# EAGLE design servo_board - no power (EAGLE 5.06)
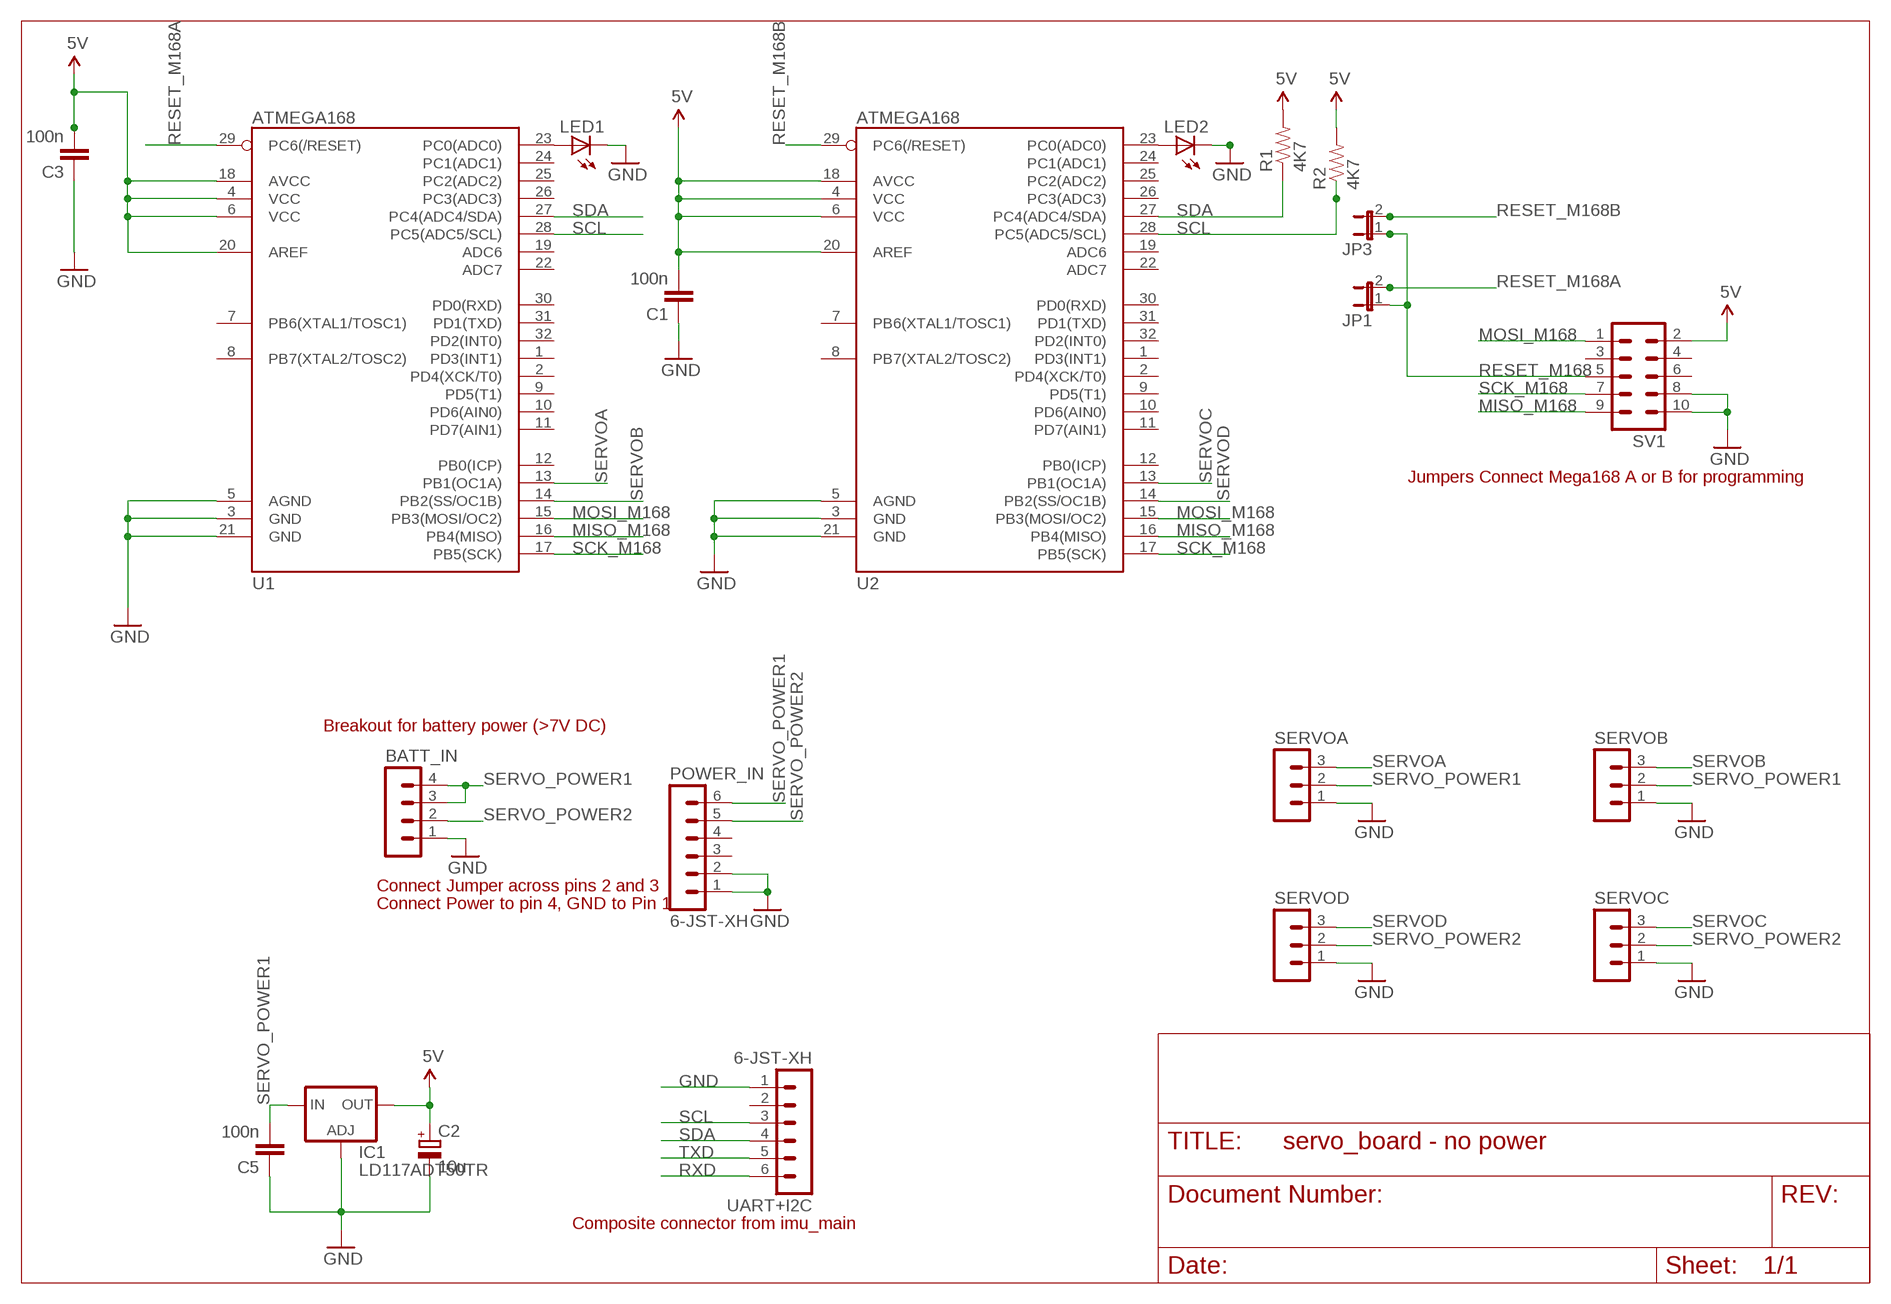
[diagram p0: schematic, sheet 1]

## Parts
BATT_IN  MA04-1  [MA04-1]
C1  100n  C-EUC0805  [C0805]
C2  10u  CPOL-EUC/6032-28R  [C/6032-28R]
C3  100n  C-EUC0805  [C0805]
C5  100n  C-EUC0805  [C0805]
IC1  LD117ADT50TR  [DPACK]
JP1  JP1E  [JP1]
JP3  JP1E  [JP1]
LED1  LEDSMT1206  [1206]
LED2  LEDSMT1206  [1206]
POWER_IN  6-JST-XH  [6]
R1  4K7  RESISTOR0603-RES  [0603-RES]
R2  4K7  RESISTOR0603-RES  [0603-RES]
SERVOA  MA03-1  [MA03-1]
SERVOB  MA03-1  [MA03-1]
SERVOC  MA03-1  [MA03-1]
SERVOD  MA03-1  [MA03-1]
SV1  MA05-2LARGE_PAD  [MA05-2A]
U1  ATMEGA168  [TQFP32-08]
U2  ATMEGA168  [TQFP32-08]
UART+I2C  6-JST-XH  [6]

## Nets
5V: C1.2 C2.+ C3.2 IC1.4(OUT) R1.2 R2.2 SV1.2 U1.4(VCC) U1.6(VCC) U1.18(AVCC) U1.20(AREF) U2.4(VCC) U2.6(VCC) U2.18(AVCC) U2.20(AREF)
GND: BATT_IN.1 C1.1 C2.- C3.1 C5.1 IC1.1(ADJ) LED1.C LED2.C POWER_IN.1 POWER_IN.2 SERVOA.1 SERVOB.1 SERVOC.1 SERVOD.1 SV1.8 SV1.10 U1.3(GND) U1.5(AGND) U1.21(GND) U2.3(GND) U2.5(AGND) U2.21(GND) UART+I2C.1
MISO_M168: SV1.9 U1.16(PB4(MISO)) U2.16(PB4(MISO))
MOSI_M168: SV1.1 U1.15(PB3(MOSI/OC2)) U2.15(PB3(MOSI/OC2))
N$8: LED1.A U1.23(PC0(ADC0))
N$9: LED2.A U2.23(PC0(ADC0))
RESET_M168: JP1.1 JP3.1 SV1.5
RESET_M168A: JP1.2 U1.29(PC6(/RESET))
RESET_M168B: JP3.2 U2.29(PC6(/RESET))
RXD: UART+I2C.6
SCK_M168: SV1.7 U1.17(PB5(SCK)) U2.17(PB5(SCK))
SCL: R2.1 U1.28(PC5(ADC5/SCL)) U2.28(PC5(ADC5/SCL)) UART+I2C.3
SDA: R1.1 U1.27(PC4(ADC4/SDA)) U2.27(PC4(ADC4/SDA)) UART+I2C.4
SERVO_POWER1: BATT_IN.3 BATT_IN.4 C5.2 IC1.3(IN) POWER_IN.6 SERVOA.2 SERVOB.2
SERVO_POWER2: BATT_IN.2 POWER_IN.5 SERVOC.2 SERVOD.2
SERVOA: SERVOA.3 U1.13(PB1(OC1A))
SERVOB: SERVOB.3 U1.14(PB2(SS/OC1B))
SERVOC: SERVOC.3 U2.13(PB1(OC1A))
SERVOD: SERVOD.3 U2.14(PB2(SS/OC1B))
TXD: UART+I2C.5
Unconnected: POWER_IN.3 POWER_IN.4 SV1.3 SV1.4 SV1.6 U1.1(PD3(INT1)) U1.2(PD4(XCK/T0)) U1.7(PB6(XTAL1/TOSC1)) U1.8(PB7(XTAL2/TOSC2)) U1.9(PD5(T1)) U1.10(PD6(AIN0)) U1.11(PD7(AIN1)) U1.12(PB0(ICP)) U1.19(ADC6) U1.22(ADC7) U1.24(PC1(ADC1)) U1.25(PC2(ADC2)) U1.26(PC3(ADC3)) U1.30(PD0(RXD)) U1.31(PD1(TXD)) U1.32(PD2(INT0)) U2.1(PD3(INT1)) U2.2(PD4(XCK/T0)) U2.7(PB6(XTAL1/TOSC1)) U2.8(PB7(XTAL2/TOSC2)) U2.9(PD5(T1)) U2.10(PD6(AIN0)) U2.11(PD7(AIN1)) U2.12(PB0(ICP)) U2.19(ADC6) U2.22(ADC7) U2.24(PC1(ADC1)) U2.25(PC2(ADC2)) U2.26(PC3(ADC3)) U2.30(PD0(RXD)) U2.31(PD1(TXD)) U2.32(PD2(INT0)) UART+I2C.2

## Notes on the sheet
- Jumpers Connect Mega168 A or B for programming
- Breakout for battery power (>7V DC)
- Connect Jumper across pins 2 and 3
- Connect Power to pin 4, GND to Pin 1
- Composite connector from imu_main

## Library data of the parts
BATT_IN = con-lstb:MA04-1: PIN HEADER
C1 C3 C5 = rcl:C-EU: CAPACITOR, European symbol
C2 = rcl:CPOL-EU: POLARIZED CAPACITOR, European symbol
IC1 = v-reg:LD117A?*: Low drop fixed and adjustable positive voltage regulators 1 A Source: http://www.st.com/stonline/products/literature/ds/7194/ld1117axx.pdf
JP1 JP3 = jumper:JP1E: JUMPER
LED1 LED2 = led:LED: LED OSRAM: - CHIPLED LG R971, LG N971, LY N971, LG Q971, LY Q971, LO R971, LY R971 LH N974, LH R974 LS Q976, LO Q976, LY Q976 LO Q996 - Hyper CHIPLED LW Q18S LB Q993, LB Q99A, LB R99A - SideLED LS A670, LO A670, LY A670, LG A670, LP A670 LB A673, LV A673, LT A673, LW A673 LH A674 LY A675 LS A676, LA A676, LO A676, LY A676, LW A676 LS A679, LY A679, LG A679 - Hyper Micro SIDELED® LS Y876, LA Y876, LO Y876, LY Y876 LT Y87S - SmartLED LW L88C, LW L88S LB L89C, LB L89S, LG L890 LS L89K, LO L89K, LY L89K LS L896, LA L896, LO L896, LY L896 - TOPLED LS T670, LO T670, LY T670, LG T670, LP T670 LSG T670, LSP T670, LSY T670, LOP T670, LYG T670 LG T671, LOG T671, LSG T671 LB T673, LV T673, LT T673, LW T673 LH T674 LS T676, LA T676, LO T676, LY T676, LB T676, LH T676, LSB T676, LW T676 LB T67C, LV T67C, LT T67C, LS T67K, LO T67K, LY T67K, LW E67C LS E67B, LA E67B, LO E67B, LY E67B, LB E67C, LV E67C, LT E67C LW T67C LS T679, LY T679, LG T679 LS T770, LO T770, LY T770, LG T770, LP T770 LB T773, LV T773, LT T773, LW T773 LH T774 LS E675, LA E675, LY E675, LS T675 LS T776, LA T776, LO T776, LY T776, LB T776 LHGB T686 LT T68C, LB T68C - Hyper Mini TOPLED® LB M676 - Mini TOPLED Santana® LG M470 LS M47K, LO M47K, LY M47K Source: http://www.osram.convergy.de LUXEON: - LUMILED® LXK2-PW12-R00, LXK2-PW12-S00, LXK2-PW14-U00, LXK2-PW14-V00 LXK2-PM12-R00, LXK2-PM12-S00, LXK2-PM14-U00 LXK2-PE12-Q00, LXK2-PE12-R00, LXK2-PE12-S00, LXK2-PE14-T00, LXK2-PE14-U00 LXK2-PB12-K00, LXK2-PB12-L00, LXK2-PB12-M00, LXK2-PB14-N00, LXK2-PB14-P00, LXK2-PB14-Q00 LXK2-PR12-L00, LXK2-PR12-M00, LXK2-PR14-Q00, LXK2-PR14-R00 LXK2-PD12-Q00, LXK2-PD12-R00, LXK2-PD12-S00 LXK2-PH12-R00, LXK2-PH12-S00 LXK2-PL12-P00, LXK2-PL12-Q00, LXK2-PL12-R00 Source: www.luxeon.com KINGBRIGHT: KA-3528ASYC Source: www.kingbright.com
POWER_IN UART+I2C = con-jst-xh:6-JST-XH
R1 R2 = SparkFun:RESISTOR: Resistor Basic schematic elements and footprints for 0603, 1206, and PTH 1/10th watt (small) resistors.
SERVOA SERVOB SERVOC SERVOD = con-lstb:MA03-1: PIN HEADER
SV1 = con-lstb:MA05-2: PIN HEADER
U1 U2 = SparkFun:ATMEGA168

## Board
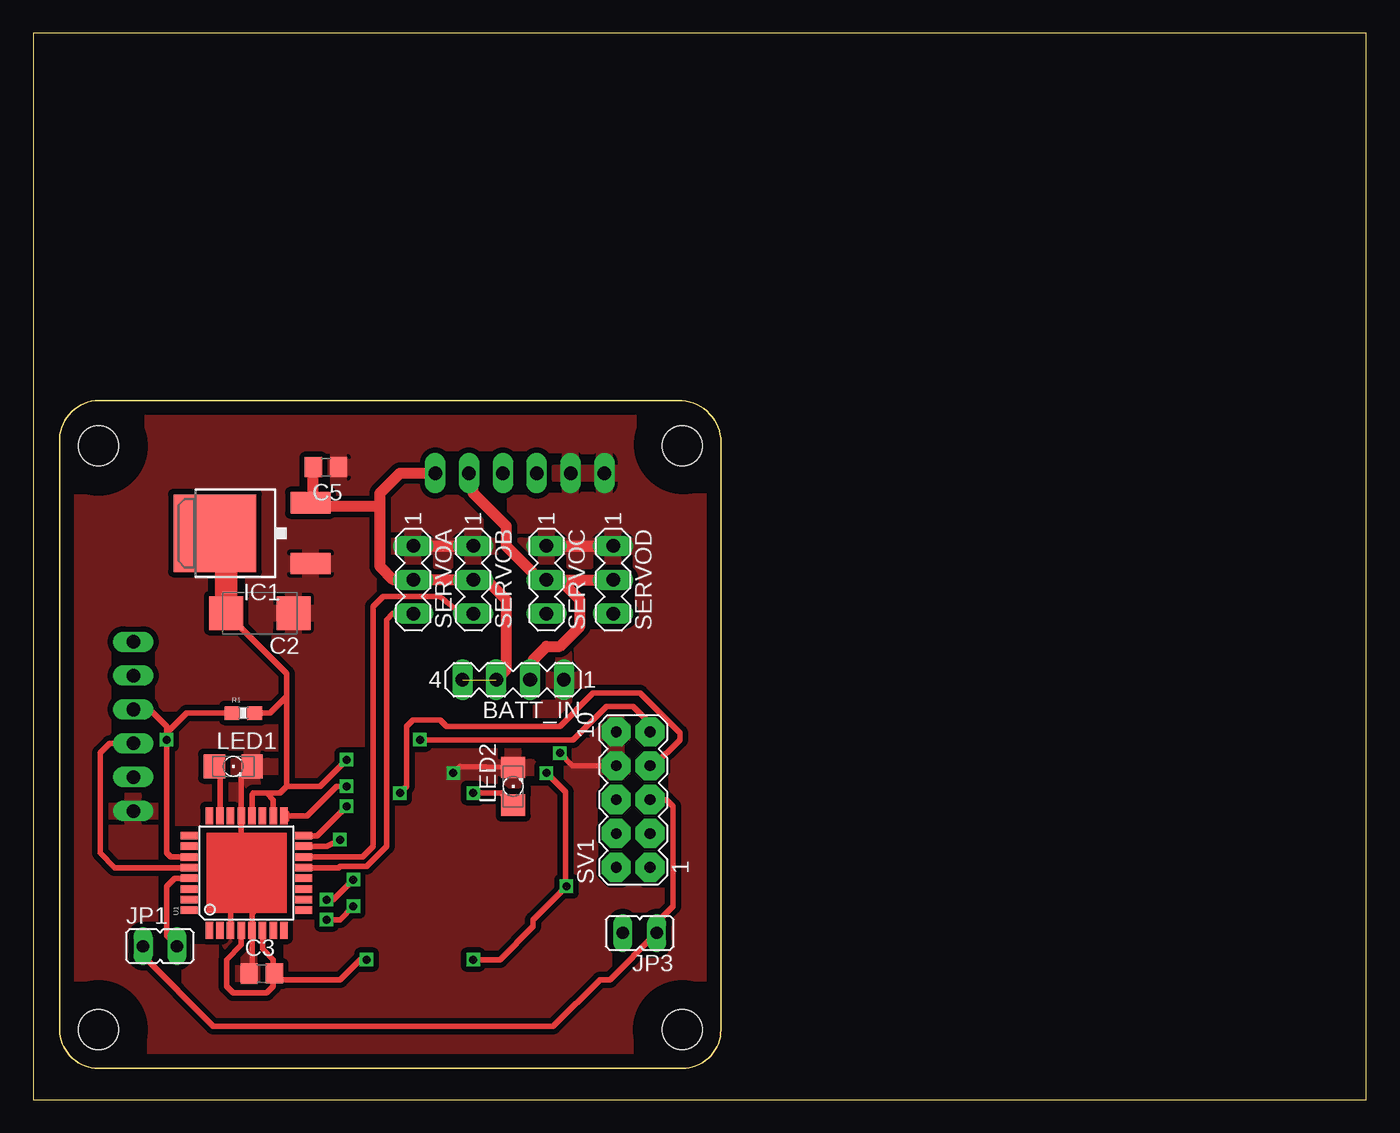
[diagram p1: board, top side]
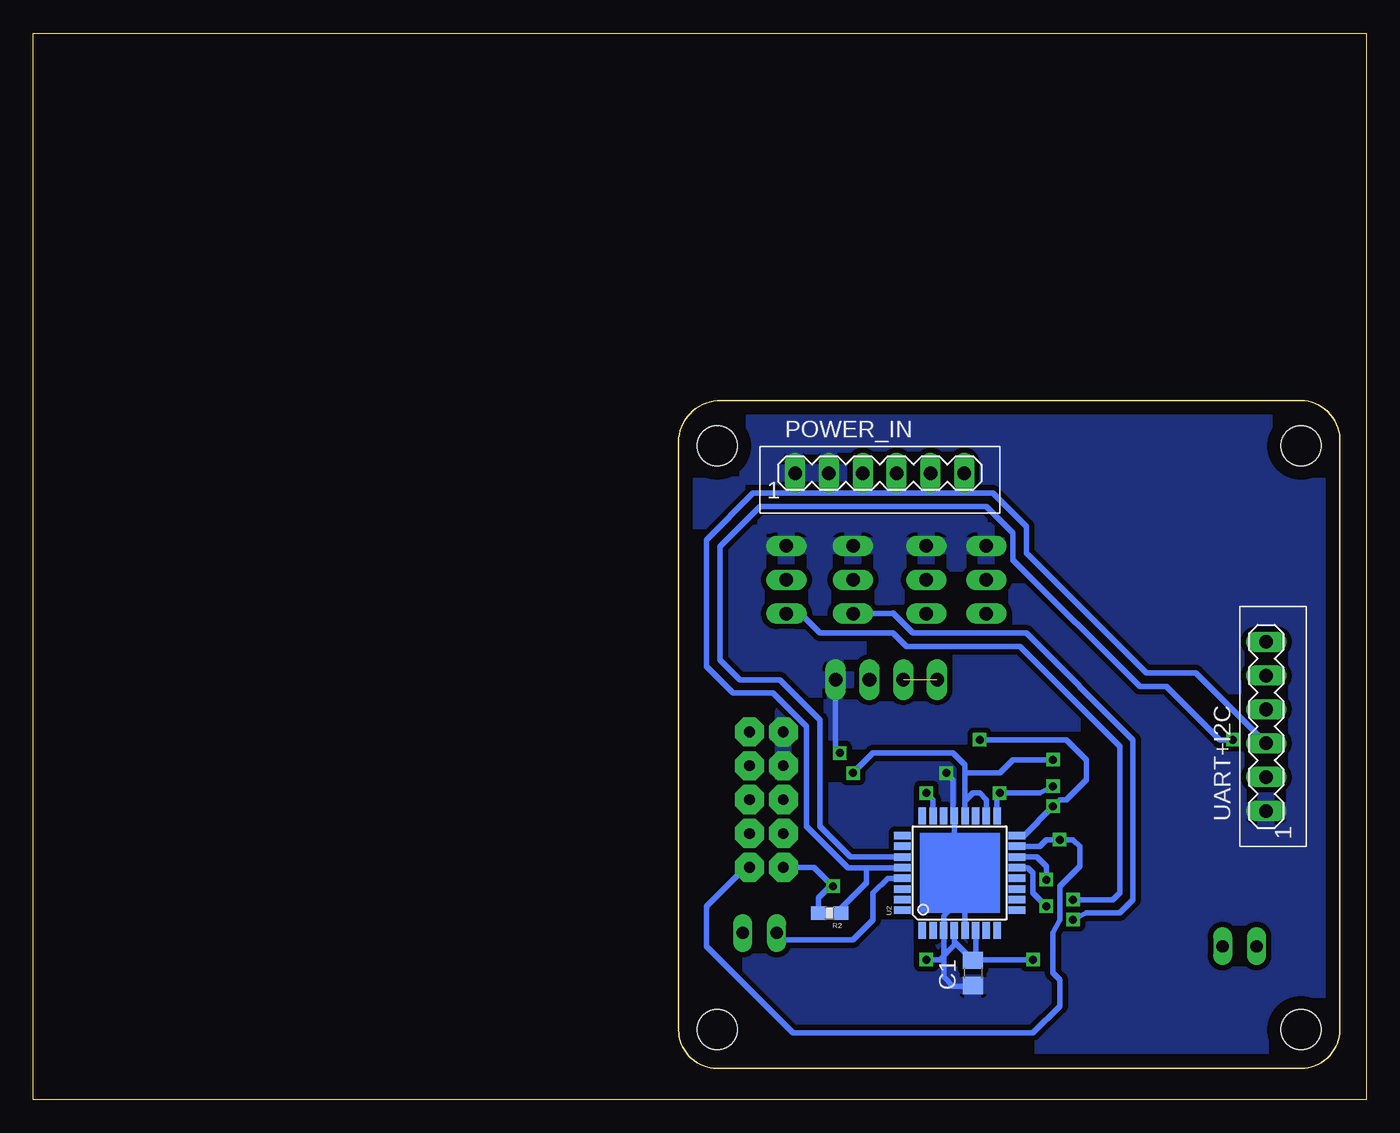
[diagram p2: board, bottom side, seen from below]

Size 100 x 80 mm. Coordinates in mm from the lower left corner, seen from the top.
Outline: 0,0 100,0 100,80 0,80 0,0
Outline: 1.99,5.24 1.99,49.04 arc-90 4.64,52.44 48.69,52.44 arc-90 51.59,49.04 51.59,5.24 arc-90 48.69,2.34 4.89,2.34 arc-90 1.99,5.24
Copper layers (1*16): Top 0.035mm / dielectric 1.5mm / Bottom 0.035mm
Design rules "default *": minimum track width 10mil, minimum drill 20mil, track to track 8mil, track to pad 8mil, pad to pad 8mil, via to via 8mil, smd to smd 8mil, copper to edge 40mil, drill to drill 8mil, minimum pad ring 10mil, minimum via ring 8mil, stop-mask expansion 4mil, vias tented up to drill 0mil, thermal gap 10mil
Holes 3 mm at 4.89,49.04 48.69,49.04 4.89,5.24 48.69,5.24
tRestrict: area 1.8,45.9 to 8,52.1; area 45.7,46 to 51.9,52.2; area 45.6,2.1 to 51.8,8.3; area 1.8,2.1 to 8,8.3

### Footprints (pad centres in the part's own frame; a part is rotated, then mirrored left to right if it is on the bottom)
MA04-1 = drill 1.016 long: 1 -3.81,0; 2 -1.27,0; 3 1.27,0; 4 3.81,0
C0805 = smd 1.3 x 1.5: 1 -0.95,0; 2 0.95,0
C/6032-28R = smd 2.55 x 2.5: + 2.525,0; - -2.525,0
DPACK = smd 1.6 x 3: 1 -2.28,-4.8; 3 2.28,-4.8 | smd 5.8 x 6.2: 4 0,2.38
JP1 = drill 0.914 long: 1 0,-1.27; 2 0,1.27
1206 = smd 1.6 x 1.803: A -1.422,0; C 1.422,0
6 = drill 1.016 long: 1 -6.35,0; 2 -3.81,0; 3 -1.27,0; 4 1.27,0; 5 3.81,0; 6 6.35,0
0603-RES = smd 1.1 x 1: 1 -0.85,0; 2 0.85,0
MA03-1 = drill 1.016 long: 1 -2.54,0; 2 0,0; 3 2.54,0
MA05-2A = drill 0.8 pad 2.184 octagon: 1 -5.08,-1.27; 2 -5.08,1.27; 3 -2.54,-1.27; 4 -2.54,1.27; 5 0,-1.27; 6 0,1.27; 7 2.54,-1.27; 8 2.54,1.27; 9 5.08,-1.27; 10 5.08,1.27
TQFP32-08 = smd 1.27 x 0.559: 1 -4.293,2.8; 2 -4.293,2; 3 -4.293,1.2; 4 -4.293,0.4; 5 -4.293,-0.4; 6 -4.293,-1.2; 7 -4.293,-2; 8 -4.293,-2.8; 17 4.293,-2.8; 18 4.293,-2; 19 4.293,-1.2; 20 4.293,-0.4; 21 4.293,0.4; 22 4.293,1.2; 23 4.293,2; 24 4.293,2.8 | smd 0.559 x 1.27: 9 -2.8,-4.293; 10 -2,-4.293; 11 -1.2,-4.293; 12 -0.4,-4.293; 13 0.4,-4.293; 14 1.2,-4.293; 15 2,-4.293; 16 2.8,-4.293; 25 2.8,4.293; 26 2,4.293; 27 1.2,4.293; 28 0.4,4.293; 29 -0.4,4.293; 30 -1.2,4.293; 31 -2,4.293; 32 -2.8,4.293

### Placement (x,y rotation side)
BATT_IN  36,31.5 180 top
C1  29.5,9.5 90 bottom
C2  17,36.5 180 top
C3  17.14,9.46 0 top
C5  21.96,47.45 180 top
IC1  16,42.5 90 top
JP1  9.5,11.5 270 top
JP3  45.5,12.5 90 top
LED1  15,25 0 top
LED2  36,23.5 90 top
POWER_IN  36.5,47 0 bottom
R1  15.75,29 0 top
R2  40.25,14 180 bottom
SERVOA  28.5,39 270 top
SERVOB  33,39 270 top
SERVOC  38.5,39 270 top
SERVOD  43.5,39 270 top
SV1  45,22.5 90 top
U1  16,17 90 top
U2  30.5,17 90 bottom
UART+I2C  7.5,28 90 bottom

### Tracks (layer width: path | path; a pad name or v marks a point on that pad's centre or on a via)
5V  (via drill 0.6)  (1 unrouted)
  Top 0.406: 14.47,42.5 IC1.4 | v33,10.5 35,10.5 37.5,13 37.5,13.5 39.92,15.92 39.92,23.08 v38.5,24.5 | U1.6 17.2,11.3 18,10.5 18,9.55 C3.2 | v25,10.5 24.5,10.5 23,9 18.55,9 C3.2 | U1.4 15.6,11.6 14.5,10.5 14.5,8.5 15,8 17.5,8 18,8.5 18,9.37 C3.2 | U1.20 16.4,22.9 16.5,23 | 17.5,23 16.5,23 | U1.18 18,22.5 17.5,23 | 19,23.5 21.5,23.5 v23.5,25.5 | 18.5,23 17.5,23 | 18.5,23 16.5,23 | 19,23.5 18.5,23 | 19,23.5 19,30.25 | 19,30.25 19,31.98 C2.+ | R1.2 17.75,29 19,30.25
  Top 1.676: C2.+ 14.47,42.5
  Bottom 0.406: U2.6 29.3,10.65 C1.2 | 30.9,11.85 U2.4 | C1.2 30.9,11.85 | v25,10.5 29.45,10.5 C1.2 | U2.18 28.5,22.5 29,23 29.5,23 30.1,22.4 U2.20 30.1,24.5 | 30.9,11.85 30.9,11.6 32,10.5 v33,10.5 | 30.1,24.5 30.1,25.1 31,26 37,26 v38.5,24.5 | 30.1,24.5 27.5,24.5 26.5,25.5 v23.5,25.5 | SV1.2 41.42,17.42 40.12,16.12 | 40.12,16.12 39.92,15.92 | R2.2 41.1,15.15 40.12,16.12
GND  (via drill 0.6)  (1 unrouted)
  Top 0.406: U1.5 16.4,12.9 16.5,13 | U1.5 16.4,9.67 C3.1 | U1.3 14.8,14.3 15,14.5 16,14.5 | 16,14.5 16.5,14 | U1.5 16.4,14.1 16,14.5 | 16,14.5 15.6,14.9 U1.21 15.6,24.18 LED1.C | SV1.8 40.46,25.04 39.5,26 | LED2.C 32,25 v31.5,24.5
  Top 0.813: SERVOA.1 SERVOB.1 | SERVOC.1 SERVOD.1
  Bottom 0.406: C1.1 29.55,8.5 31,8.5 31.7,9.2 U2.3 31.7,13.8 31,14.5 30.5,14.5 | U2.5 30.1,14.1 30.5,14.5 | 30.5,14.5 30.9,14.9 U2.21 30.9,21.1 31,21 31,24 v31.5,24.5 | BATT_IN.1 39.81,26.31 39.5,26
  pour Top (isolate 0.406): 2.5,3 51,3 51,51.5 2.5,51.5
  pour Bottom (isolate 0.406): 3,3 51,3 51,51.5 2.5,51.5 2.5,3
MISO_M168  (via drill 0.6)
  Top 0.406: U1.16 21.3,19.8 v23.5,22 | SV1.9 46.27,28.23 45,29.5 43,29.5 40.5,27 v29,27
  Bottom 0.406: U2.16 25.7,19.8 v23.5,22 23,22.5 22.5,22.5 21,24 21,25.5 22.5,27 v29,27
MOSI_M168  (via drill 0.6)
  Top 0.406: U1.15 22,19 v23,19.5
  Bottom 0.406: SV1.1 46.58,17.42 49.5,14.5 49.5,11.5 43,5 25,5 23,7 23,9 23.5,9.5 23.5,12.5 23,13.5 23,16 21.5,17.5 21.5,19 22,19.5 v23,19.5 24,19.5 24.5,19 U2.15
N$8
  Top 0.406: U1.23 14,24.58 LED1.A
N$9  (via drill 0.6)
  Top 0.406: v33,23 35.08,23 LED2.A
  Bottom 0.406: U2.23 32.5,22.5 v33,23
N$10
  Top 0.406: 19,21.5 19,21
N$26  (via drill 0.6)
  other vias: 24,16.5
N$30  (via drill 0.6)
  other vias: 40,16
N$31  (via drill 0.6)
  other vias: 39.5,26
RESET_M168
  Top 0.406: SV1.5 47.5,22.5 48,22 48,14.5 46.77,13.27 JP3.1 43.27,9 42.5,9 39,5.5 13.5,5.5 8.23,10.77 JP1.1 | SV1.5
RESET_M168A
  Top 0.406: U1.29 10.6,16.6 10,16 10,12.27 JP1.2
RESET_M168B
  Bottom 0.406: U2.29 35.9,16.6 37,15.5 37,13.5 38.5,12 43.73,12 JP3.2
SCK_M168  (via drill 0.6)
  Top 0.406: v27.5,23 28,23.5 28,28 28.5,28.5 30.5,28.5 31,28 39.5,28 42,30.5 45.5,30.5 48.5,27.5 48.5,27 46.54,25.04 SV1.7 | v23.5,23.5 22.75,23.5 20.54,21.29 U1.17
  Bottom 0.406: U2.17 27.7,22.8 v27.5,23 24.5,23 v23.5,23.5
SCL
  Top 0.406: UART+I2C.3 5.73,26.73 5,26 5,18.5 6.1,17.4 U1.28
  Bottom 0.406: 37.5,17.4 38.9,17.4 42,20.5 42,28 44.5,30.5 47.5,30.5 49.5,32.5 49.5,42 46,45.5 28,45.5 25.5,43 25.5,41 16.5,32 12.77,32 UART+I2C.3 | 37.5,17.4 U2.28 | R2.1 39.4,14.35 37.5,16.25 37.5,17.4
SDA  (via drill 0.6)
  Top 0.406: UART+I2C.4 8.73,29.27 10,28 10,27.5 | U1.27 10.3,18.2 10,18.5 v10,27 10,27.5 | R1.1 11.5,29 10,27.5
  Bottom 0.406: U2.27 38.7,18.2 41,20.5 41,28.5 44,31.5 47,31.5 48.5,33 48.5,41.5 45.5,44.5 28.5,44.5 26.5,42.5 26.5,40.5 17,31 15,31 11,27 v10,27
SERVO_POWER1  (1 unrouted)
  Top 0.406: IC1.3 21.01,44.78
  Top 0.813: 21.01,44.78 C5.2 | 26,44.5 26,40 27,39 SERVOA.2 SERVOB.2 34,39 35.5,37.5 35.5,32.27 BATT_IN.3 | 26,44.5 21.08,44.5 IC1.3 | 26,44.5 26,45.5 27.5,47 POWER_IN.6
SERVO_POWER2
  Top 0.813: SERVOC.2 SERVOD.2 | SERVOC.2 39.5,39 41,37.5 41,35.5 39.5,34 38.5,34 37.5,33 37.5,31.73 BATT_IN.2 | SERVOC.2 38,39 35.5,41.5 35.5,43 33,45.5 33,46.69 POWER_IN.5
SERVOA
  Top 0.406: SERVOA.3 26.96,36.46 26.5,36 26.5,19 25,17.5 23,17.5 22.9,17.4 U1.13
SERVOB
  Top 0.406: SERVOB.3 32.04,36.46 30.5,37.75 26.25,37.75 25.5,37 25.5,19 24.7,18.2 U1.14
SERVOC  (via drill 0.6)
  Top 0.406: v22,13.5 23,13.5 v24,14.5
  Bottom 0.406: SERVOC.3 35.54,36.46 35.5,36.5 34,35 25.5,35 17.5,27 17.5,15 18.5,14 21,14 v22,13.5 | U2.13 25.4,17.4 25,17 25,15.5 v24,14.5
SERVOD  (via drill 0.6)  (1 unrouted)
  Top 0.406: v22,15 22.5,15 24,16.5
  Bottom 0.406: SERVOD.3 42.46,36.46 41,35 35.5,35 34.5,34 26,34 18.5,26.5 18.5,15.5 19,15 v22,15 | U2.14 24.7,18.2 24,17.5 24,16.5
(copper drawn outside any net)
  shapes: Bottom area x1, Top area x1